# EAGLE schematic Project Embedded Lap Counting (EAGLE 6.2)
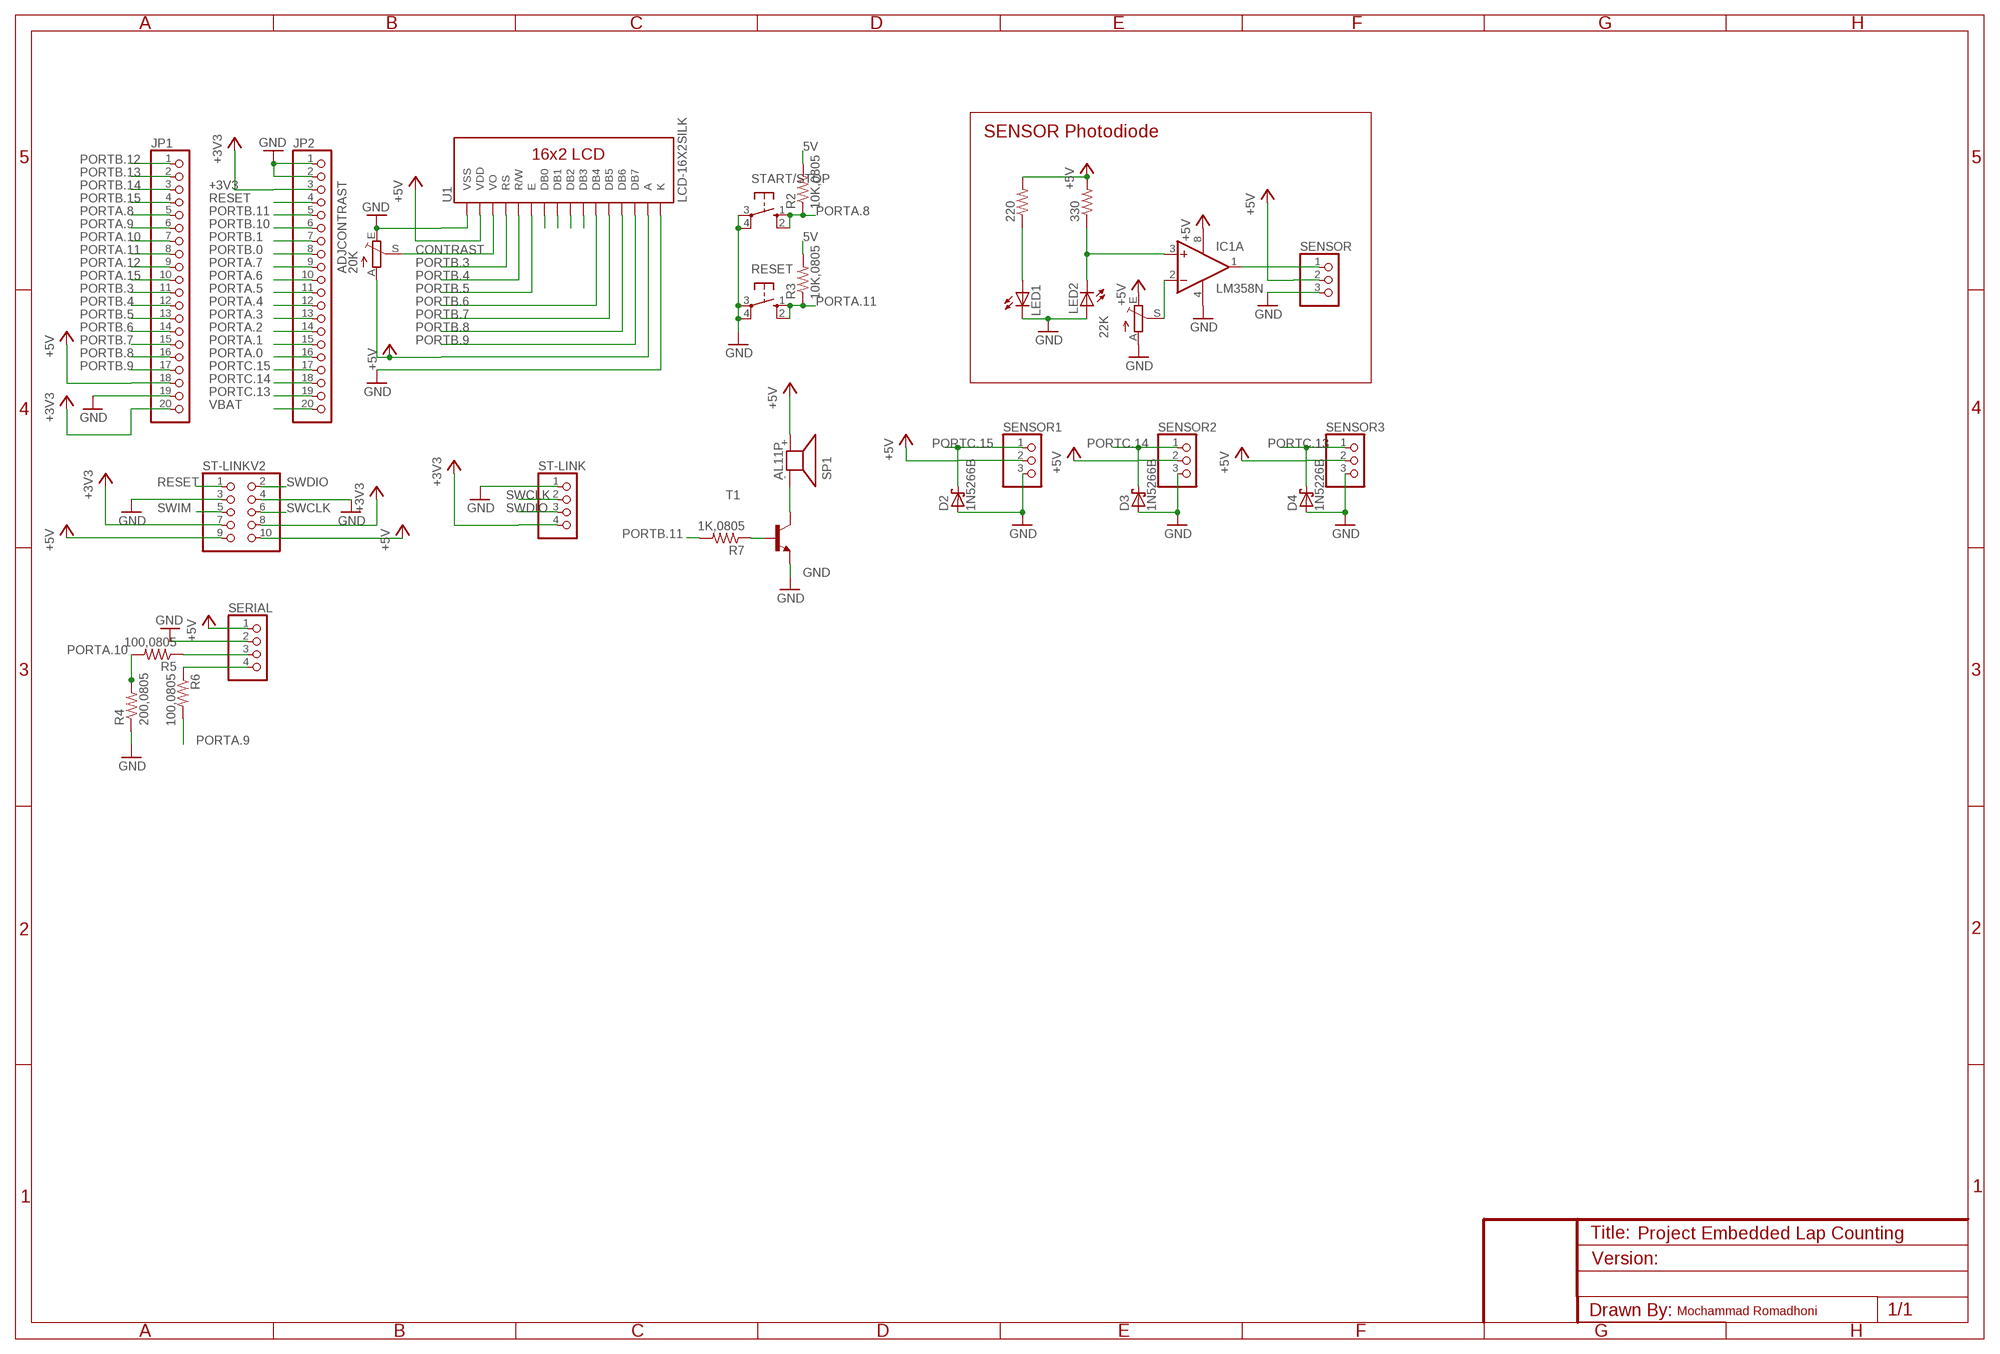
[diagram p0: schematic, sheet 1]

## Parts
22K  TRIM_EU-CA6V  [CA6V]
220  R-US_0204/7  [0204/7]
330  R-US_0204/7  [0204/7]
ADJCONTRAST  20K  TRIM_EU-CA6V  [CA6V]
D2  1N5266B  BAT42  [DO35-10]
D3  1N5266B  BAT42  [DO35-10]
D4  1N5226B  BAT42  [DO35-10]
IC1  LM358N  [DIL08]
JP1  PINHD-1X20  [1X20]
JP2  PINHD-1X20  [1X20]
LED1  LED3MM  [LED3MM]
LED2  LED3MM  [LED3MM]
R2  10K,0805  R-US_M0805  [M0805]
R3  10K,0805  R-US_M0805  [M0805]
R4  200,0805  R-US_M0805  [M0805]
R5  100,0805  R-US_M0805  [M0805]
R6  100,0805  R-US_M0805  [M0805]
R7  1K,0805  R-US_M0805  [M0805]
RESET  40-XX  [B3F-40XX]
SENSOR  PINHD-1X3  [1X03]
SENSOR1  PINHD-1X3  [1X03]
SENSOR2  PINHD-1X3  [1X03]
SENSOR3  PINHD-1X3  [1X03]
SERIAL  PINHD-1X4  [1X04]
SP1  AL11P  [AL11P]
ST-LINK  PINHD-1X4  [1X04]
ST-LINKV2  PINHD-2X5  [2X05]
START/STOP  40-XX  [B3F-40XX]
T1  -NPN-SOT23-EBC  [SOT23-EBC]
U1  LCD-16X2SILK  [LCD-16X2]

## Nets
5V: R2.2 R3.2
+3V3: JP1.20 JP2.3 ST-LINK.4 ST-LINKV2.7 ST-LINKV2.8
+5V: 22K.E 220.2 330.2 ADJCONTRAST.A IC1.8(P:V+) JP1.18 SENSOR1.2 SENSOR2.2 SENSOR3.2 SENSOR.2 SERIAL.1 SP1.+ ST-LINKV2.9 ST-LINKV2.10 U1.2(VDD) U1.15(A)
CONTRAST: ADJCONTRAST.S U1.3(VO)
GND: 22K.A ADJCONTRAST.E D2.A D3.A D4.A IC1.4(P:V-) JP1.19 JP2.1 JP2.2 LED1.K(C) LED2.A R4.1 RESET.3(P) RESET.4(P1) SENSOR1.3 SENSOR2.3 SENSOR3.3 SENSOR.3 SERIAL.2 ST-LINK.1 ST-LINKV2.3 ST-LINKV2.4 START/STOP.3(P) START/STOP.4(P1) T1.E U1.1(VSS) U1.16(K)
N$1: SP1.- T1.C
N$2: R7.1 T1.B
N$3: 220.1 LED1.A
N$7: U1.7(DB0)
N$8: U1.8(DB1)
N$9: U1.9(DB2)
N$10: U1.10(DB3)
N$11: 22K.S IC1.2(A:-IN)
N$12: IC1.1(A:OUT) SENSOR.1
N$17: R5.1 SERIAL.3
N$18: R6.1 SERIAL.4
N$498989: 330.1 IC1.3(A:+IN) LED2.K(C)
PORTA.0: JP2.16
PORTA.1: JP2.15
PORTA.2: JP2.14
PORTA.3: JP2.13
PORTA.4: JP2.12
PORTA.5: JP2.11
PORTA.6: JP2.10
PORTA.7: JP2.9
PORTA.8: JP1.5 R2.1 START/STOP.1(S) START/STOP.2(S1)
PORTA.9: JP1.6 R6.2
PORTA.10: JP1.7 R4.2 R5.2
PORTA.11: JP1.8 R3.1 RESET.1(S) RESET.2(S1)
PORTA.12: JP1.9
PORTA.15: JP1.10
PORTB.0: JP2.8
PORTB.1: JP2.7
PORTB.3: JP1.11 U1.4(RS)
PORTB.4: JP1.12 U1.5(R/W)
PORTB.5: JP1.13 U1.6(E)
PORTB.6: JP1.14 U1.11(DB4)
PORTB.7: JP1.15 U1.12(DB5)
PORTB.8: JP1.16 U1.13(DB6)
PORTB.9: JP1.17 U1.14(DB7)
PORTB.10: JP2.6
PORTB.11: JP2.5 R7.2
PORTB.12: JP1.1
PORTB.13: JP1.2
PORTB.14: JP1.3
PORTB.15: JP1.4
PORTC.13: D4.C JP2.19 SENSOR3.1
PORTC.14: D3.C JP2.18 SENSOR2.1
PORTC.15: D2.C JP2.17 SENSOR1.1
RESET: JP2.4 ST-LINKV2.1
SWCLK: ST-LINK.2 ST-LINKV2.6
SWDIO: ST-LINK.3 ST-LINKV2.2
SWIM: ST-LINKV2.5
VBAT: JP2.20
Unconnected: IC1.5(B:+IN) IC1.6(B:-IN) IC1.7(B:OUT)

## Notes on the sheet
- SENSOR Photodiode
- Mochammad Romadhoni

## Library data of the parts
22K ADJCONTRAST = pot:TRIM_EU-: POTENTIOMETER
220 330 R2-R7 = rcl:R-US_: RESISTOR, American symbol
D2-D4 = diode:BAT42: DIODE barrier diode
IC1 = linear:LM358: OP AMP also LM158; LM258; LM2904 Source: http://cache.national.com/ds/LM/LM158.pdf
JP1 JP2 = pinhead:PINHD-1X20: PIN HEADER
LED1 LED2 = led:LED: LED OSRAM: - CHIPLED LG R971, LG N971, LY N971, LG Q971, LY Q971, LO R971, LY R971 LH N974, LH R974 LS Q976, LO Q976, LY Q976 LO Q996 - Hyper CHIPLED LW Q18S LB Q993, LB Q99A, LB R99A - SideLED LS A670, LO A670, LY A670, LG A670, LP A670 LB A673, LV A673, LT A673, LW A673 LH A674 LY A675 LS A676, LA A676, LO A676, LY A676, LW A676 LS A679, LY A679, LG A679 - Hyper Micro SIDELED® LS Y876, LA Y876, LO Y876, LY Y876 LT Y87S - SmartLED LW L88C, LW L88S LB L89C, LB L89S, LG L890 LS L89K, LO L89K, LY L89K LS L896, LA L896, LO L896, LY L896 - TOPLED LS T670, LO T670, LY T670, LG T670, LP T670 LSG T670, LSP T670, LSY T670, LOP T670, LYG T670 LG T671, LOG T671, LSG T671 LB T673, LV T673, LT T673, LW T673 LH T674 LS T676, LA T676, LO T676, LY T676, LB T676, LH T676, LSB T676, LW T676 LB T67C, LV T67C, LT T67C, LS T67K, LO T67K, LY T67K, LW E67C LS E67B, LA E67B, LO E67B, LY E67B, LB E67C, LV E67C, LT E67C LW T67C LS T679, LY T679, LG T679 LS T770, LO T770, LY T770, LG T770, LP T770 LB T773, LV T773, LT T773, LW T773 LH T774 LS E675, LA E675, LY E675, LS T675 LS T776, LA T776, LO T776, LY T776, LB T776 LHGB T686 LT T68C, LB T68C - Hyper Mini TOPLED® LB M676 - Mini TOPLED Santana® LG M470 LS M47K, LO M47K, LY M47K Source: http://www.osram.convergy.de LUXEON: - LUMILED® LXK2-PW12-R00, LXK2-PW12-S00, LXK2-PW14-U00, LXK2-PW14-V00 LXK2-PM12-R00, LXK2-PM12-S00, LXK2-PM14-U00 LXK2-PE12-Q00, LXK2-PE12-R00, LXK2-PE12-S00, LXK2-PE14-T00, LXK2-PE14-U00 LXK2-PB12-K00, LXK2-PB12-L00, LXK2-PB12-M00, LXK2-PB14-N00, LXK2-PB14-P00, LXK2-PB14-Q00 LXK2-PR12-L00, LXK2-PR12-M00, LXK2-PR14-Q00, LXK2-PR14-R00 LXK2-PD12-Q00, LXK2-PD12-R00, LXK2-PD12-S00 LXK2-PH12-R00, LXK2-PH12-S00 LXK2-PL12-P00, LXK2-PL12-Q00, LXK2-PL12-R00 Source: www.luxeon.com KINGBRIGHT: KA-3528ASYC Source: www.kingbright.com
RESET START/STOP = switch-omron:40-XX: OMRON SWITCH; MF: OMRON COMPONENTS USA; MPN: B3F-4000; OC_FARNELL: 176434; OC_NEWARK: 36K3105
SENSOR SENSOR1-SENSOR3 = pinhead:PINHD-1X3: PIN HEADER
SERIAL ST-LINK = pinhead:PINHD-1X4: PIN HEADER
SP1 = buzzer:AL11P: SPEAKER Source: Buerklin; OC_FARNELL: unknown; OC_NEWARK: unknown
ST-LINKV2 = pinhead:PINHD-2X5: PIN HEADER
T1 = transistor:*-NPN-: NPN Transistror BF959 corrected 2008.03.06
U1 = SparkFun:LCD-16X2